# Altium schematic sheet bai 1.SchDoc
size A
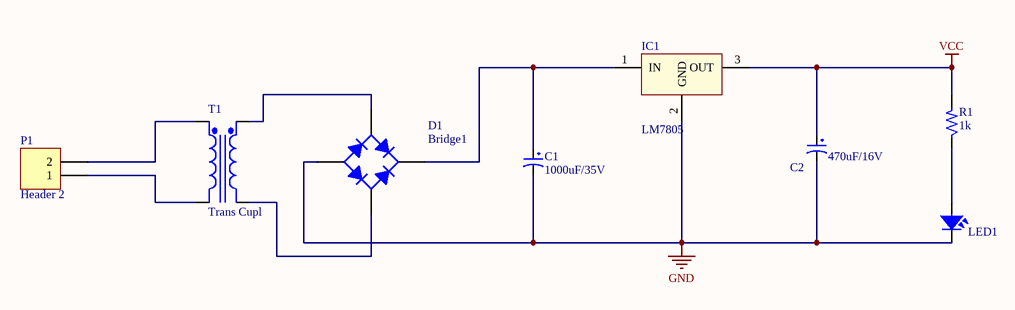
[diagram p0: bai 1.SchDoc]

## Parts
C1  1000uF/35V  [CP4/8.5]
C2  470uF/16V  [CP4/8.5]
D1  Bridge1  [D-38]
IC1  LM7805  [QTO-220]
LED1  LED  [LED-3]  (value not drawn)
P1  Header 2  [HDR1X2]
R1  1k  [SM-RES-1206]
T1  Trans Cupl  [TRF_4]

## Nets
GND: C1.2 C2.2 D1.3(A) IC1.2(GND) LED1.2
VCC: C2.1 IC1.3(OUT) R1.2
NetC1_1: C1.1 D1.1(K) IC1.1(IN)
NetD1_2: D1.2(C) T1.4(Sec-)
NetD1_4: D1.4(C) T1.3(Sec+)
NetLED1_1: LED1.1 R1.1
NetP1_1: P1.1 T1.2(Pri-)
NetP1_2: P1.2 T1.1(Pri+)

## Library data of the parts
C1 C2 = CP7: Cap 4700uF/50V; Value: 4700uF/50V
D1 = Bridge1: Full Wave Diode Bridge; Published: 8-Jun-2000; LatestRevisionDate: 29-May-2009; LatestRevisionNote: Sch pins A & K swapped.; DatasheetVersion: E2732B; PackageReference: D-38; Publisher: Altium Limited; PackageDescription: Bridge Rectifier; 4 Terminals; Body 9.4 x 9.4 mm (typ); Pitch 5.08 mm
IC1 = LM78xx: On ap +, from + 5 to + 24VDC; Value: LM7805
LED1 = LED: LED Single colour Green and Red; Value: LED 3 ly Single Colour
P1 = Header 2: Header, 2-Pin; LatestRevisionDate: 17-Jul-2002; LatestRevisionNote: Re-released for DXP Platform.; Publisher: Altium Limited
R1 = R: Resistor 1/4W; Value: R1/4W - 1K
T1 = Trans Cupl: Transformer (Coupled Inductor Model); Published: 8-Jun-2000; LatestRevisionDate: 17-Jul-2002; LatestRevisionNote: Re-released for DXP Platform.; PackageReference: TRF_4; Publisher: Altium Limited; PackageDescription: Transformer; 4 Leads